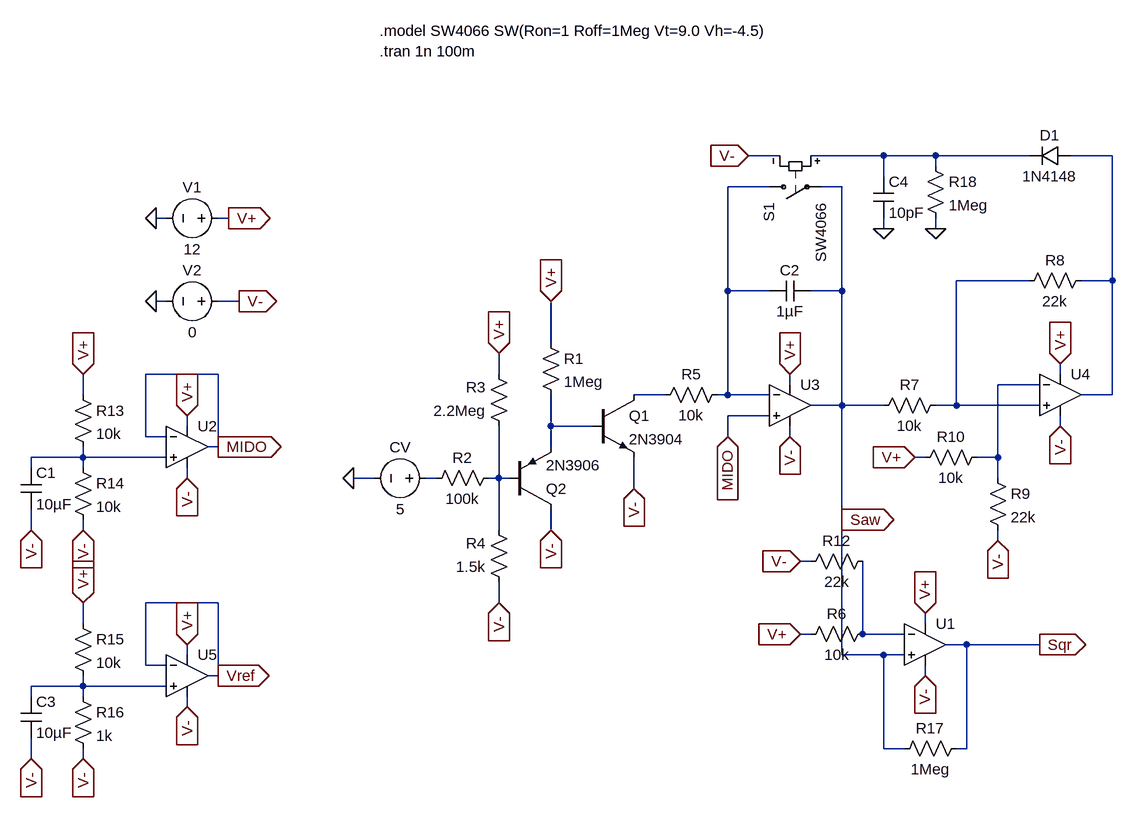
[diagram p0: schematic saw_core_4066_exp.asc]
saw_core_4066_exp.asc, the LTspice schematic file:
Version 4
SHEET 1 1448 968
WIRE 624 -32 576 -32
WIRE 784 -32 672 -32
WIRE 864 -32 784 -32
WIRE 1008 -32 864 -32
WIRE 1136 -32 1072 -32
WIRE 864 -16 864 -32
WIRE 784 0 784 -32
WIRE 608 16 544 16
WIRE 720 16 688 16
WIRE -320 64 -336 64
WIRE -224 64 -240 64
WIRE 784 80 784 64
WIRE 864 80 864 64
WIRE 1008 160 896 160
WIRE 1136 160 1136 -32
WIRE 1136 160 1088 160
WIRE 544 176 544 16
WIRE 608 176 544 176
WIRE 720 176 720 16
WIRE 720 176 672 176
WIRE -320 192 -336 192
WIRE -208 192 -240 192
WIRE 272 256 272 192
WIRE -240 304 -352 304
WIRE 192 304 192 272
WIRE 1056 304 1056 288
WIRE 640 320 640 304
WIRE 1024 320 960 320
WIRE -448 336 -448 304
WIRE 448 336 400 336
WIRE 544 336 544 176
WIRE 544 336 528 336
WIRE 608 336 544 336
WIRE 1136 336 1136 160
WIRE 1136 336 1088 336
WIRE 720 352 720 176
WIRE 720 352 672 352
WIRE 784 352 720 352
WIRE 896 352 896 160
WIRE 896 352 864 352
WIRE 1024 352 896 352
WIRE 608 368 544 368
WIRE -288 384 -288 368
WIRE 272 384 272 336
WIRE 336 384 272 384
WIRE 1056 384 1056 368
WIRE -352 400 -352 304
WIRE -320 400 -352 400
WIRE 544 400 544 368
WIRE 640 400 640 384
WIRE -240 416 -240 304
WIRE -240 416 -256 416
WIRE 272 416 272 384
WIRE -448 432 -448 416
WIRE -448 432 -528 432
WIRE -320 432 -448 432
WIRE 848 432 832 432
WIRE 960 432 960 320
WIRE 960 432 928 432
WIRE -528 448 -528 432
WIRE -448 448 -448 432
WIRE -288 464 -288 448
WIRE 0 464 -32 464
WIRE 96 464 80 464
WIRE 192 464 192 384
WIRE 192 464 176 464
WIRE 208 464 192 464
WIRE 960 464 960 432
WIRE 400 480 400 432
WIRE 720 528 720 352
WIRE -528 544 -528 512
WIRE -448 544 -448 528
WIRE 192 544 192 464
WIRE 272 544 272 512
WIRE 960 560 960 544
WIRE 672 592 656 592
WIRE -240 656 -352 656
WIRE 192 656 192 624
WIRE -448 688 -448 656
WIRE 848 688 848 672
WIRE 672 704 656 704
WIRE 752 704 752 592
WIRE 816 704 752 704
WIRE 912 720 880 720
WIRE 1024 720 912 720
WIRE -288 736 -288 720
WIRE 720 736 720 528
WIRE 784 736 720 736
WIRE 816 736 784 736
WIRE -352 752 -352 656
WIRE -320 752 -352 752
WIRE -240 768 -240 656
WIRE -240 768 -256 768
WIRE 848 768 848 752
WIRE -448 784 -448 768
WIRE -448 784 -528 784
WIRE -320 784 -448 784
WIRE -528 800 -528 784
WIRE -448 800 -448 784
WIRE -288 816 -288 800
WIRE 784 880 784 736
WIRE 816 880 784 880
WIRE 912 880 912 720
WIRE 912 880 896 880
WIRE -528 896 -528 864
WIRE -448 896 -448 880
FLAG -336 64 0
FLAG -336 192 0
FLAG -224 64 V+
IOPIN -224 64 Out
FLAG -208 192 V-
IOPIN -208 192 Out
FLAG -240 416 MIDO
IOPIN -240 416 Out
FLAG 640 304 V+
IOPIN 640 304 In
FLAG 640 400 V-
IOPIN 640 400 In
FLAG 544 400 MIDO
IOPIN 544 400 In
FLAG 1056 288 V+
IOPIN 1056 288 In
FLAG 1056 384 V-
IOPIN 1056 384 In
FLAG 576 -32 V-
IOPIN 576 -32 In
FLAG 960 560 V-
IOPIN 960 560 In
FLAG 832 432 V+
IOPIN 832 432 In
FLAG -32 464 0
FLAG 400 480 V-
IOPIN 400 480 In
FLAG 272 192 V+
IOPIN 272 192 In
FLAG 272 544 V-
IOPIN 272 544 In
FLAG 192 656 V-
IOPIN 192 656 In
FLAG 192 272 V+
IOPIN 192 272 In
FLAG -288 368 V+
IOPIN -288 368 In
FLAG -288 464 V-
IOPIN -288 464 In
FLAG -448 304 V+
IOPIN -448 304 In
FLAG -448 544 V-
IOPIN -448 544 In
FLAG -528 544 V-
IOPIN -528 544 In
FLAG -240 768 Vref
IOPIN -240 768 Out
FLAG -288 720 V+
IOPIN -288 720 In
FLAG -288 816 V-
IOPIN -288 816 In
FLAG -448 656 V+
IOPIN -448 656 In
FLAG -448 896 V-
IOPIN -448 896 In
FLAG -528 896 V-
IOPIN -528 896 In
FLAG 720 528 Saw
IOPIN 720 528 Out
FLAG 784 80 0
FLAG 848 672 V+
IOPIN 848 672 In
FLAG 848 768 V-
IOPIN 848 768 In
FLAG 1024 720 Sqr
IOPIN 1024 720 Out
FLAG 656 704 V+
IOPIN 656 704 In
FLAG 656 592 V-
IOPIN 656 592 In
FLAG 864 80 0
SYMBOL voltage -224 64 R90
WINDOW 0 -32 56 VBottom 2
WINDOW 3 32 56 VTop 2
SYMATTR InstName V1
SYMATTR Value 12
SYMBOL voltage -224 192 R90
WINDOW 0 -32 56 VBottom 2
WINDOW 3 32 56 VTop 2
SYMATTR InstName V2
SYMATTR Value 0
SYMBOL Opamps/UniversalOpamp2 640 352 R0
SYMATTR InstName U3
SYMBOL cap 672 160 R90
WINDOW 0 0 32 VBottom 2
WINDOW 3 32 32 VTop 2
SYMATTR InstName C2
SYMATTR Value 1µF
SYMBOL res 880 336 R90
WINDOW 0 0 56 VBottom 2
WINDOW 3 32 56 VTop 2
SYMATTR InstName R7
SYMATTR Value 10k
SYMBOL res 1104 144 R90
WINDOW 0 0 56 VBottom 2
WINDOW 3 32 56 VTop 2
SYMATTR InstName R8
SYMATTR Value 22k
SYMBOL Opamps/UniversalOpamp2 1056 336 R0
SYMATTR InstName U4
SYMBOL sw 592 16 M90
SYMATTR InstName S1
SYMATTR Value SW4066
SYMBOL res 944 448 R0
SYMATTR InstName R9
SYMATTR Value 22k
SYMBOL res 944 416 R90
WINDOW 0 0 56 VBottom 2
WINDOW 3 32 56 VTop 2
SYMATTR InstName R10
SYMATTR Value 10k
SYMBOL diode 1072 -48 R90
WINDOW 0 0 32 VBottom 2
WINDOW 3 32 32 VTop 2
SYMATTR InstName D1
SYMATTR Value 1N4148
SYMBOL res 544 320 R90
WINDOW 0 0 56 VBottom 2
WINDOW 3 32 56 VTop 2
SYMATTR InstName R5
SYMATTR Value 10k
SYMBOL voltage 96 464 R90
WINDOW 0 -32 56 VBottom 2
WINDOW 3 32 56 VTop 2
SYMATTR InstName CV
SYMATTR Value 5
SYMBOL npn 336 336 R0
SYMATTR InstName Q1
SYMATTR Value 2N3904
SYMBOL pnp 208 512 M180
SYMATTR InstName Q2
SYMATTR Value 2N3906
SYMBOL res 256 240 R0
SYMATTR InstName R1
SYMATTR Value 1Meg
SYMBOL res 192 448 R90
WINDOW 0 0 56 VBottom 2
WINDOW 3 32 56 VTop 2
SYMATTR InstName R2
SYMATTR Value 100k
SYMBOL res 208 400 R180
WINDOW 0 36 76 Left 2
WINDOW 3 36 40 Left 2
SYMATTR InstName R3
SYMATTR Value 2.2Meg
SYMBOL res 208 640 R180
WINDOW 0 36 76 Left 2
WINDOW 3 36 40 Left 2
SYMATTR InstName R4
SYMATTR Value 1.5k
SYMBOL Opamps/UniversalOpamp2 -288 416 R0
SYMATTR InstName U2
SYMBOL res -464 320 R0
SYMATTR InstName R13
SYMATTR Value 10k
SYMBOL res -464 432 R0
SYMATTR InstName R14
SYMATTR Value 10k
SYMBOL cap -544 448 R0
SYMATTR InstName C1
SYMATTR Value 10µF
SYMBOL Opamps/UniversalOpamp2 -288 768 R0
SYMATTR InstName U5
SYMBOL res -464 672 R0
SYMATTR InstName R15
SYMATTR Value 10k
SYMBOL res -464 784 R0
SYMATTR InstName R16
SYMATTR Value 1k
SYMBOL cap -544 800 R0
SYMATTR InstName C3
SYMATTR Value 10µF
SYMBOL cap 768 0 R0
SYMATTR InstName C4
SYMATTR Value 10pF
SYMBOL Opamps/UniversalOpamp2 848 720 R0
SYMATTR InstName U1
SYMBOL res 768 688 R90
WINDOW 0 0 56 VBottom 2
WINDOW 3 32 56 VTop 2
SYMATTR InstName R6
SYMATTR Value 10k
SYMBOL res 768 576 R90
WINDOW 0 0 56 VBottom 2
WINDOW 3 32 56 VTop 2
SYMATTR InstName R12
SYMATTR Value 22k
SYMBOL res 912 864 R90
WINDOW 0 0 56 VBottom 2
WINDOW 3 32 56 VTop 2
SYMATTR InstName R17
SYMATTR Value 1Meg
SYMBOL res 848 -32 R0
SYMATTR InstName R18
SYMATTR Value 1Meg
TEXT 8 -224 Left 2 !.model SW4066 SW(Ron=1 Roff=1Meg Vt=9.0 Vh=-4.5)\n.tran 1n 100m

The netlist it stands for:
* saw_core_4066_exp.asc
V1 V+ 0 12
V2 V- 0 0
XU3 MIDO N003 V+ V- Saw level.2 Avol=1Meg GBW=10Meg Slew=10Meg ilimit=25m rail=0 Vos=0 phimargin=45 en=0 enk=0 in=0 ink=0 Rin=500Meg  ; pins IN+ IN- V+ V- OUT
C2 Saw N003 1µF
R7 N004 Saw 10k
R8 N002 N004 22k
XU4 N004 N005 V+ V- N002 level.2 Avol=1Meg GBW=10Meg Slew=10Meg ilimit=25m rail=0 Vos=0 phimargin=45 en=0 enk=0 in=0 ink=0 Rin=500Meg  ; pins IN+ IN- V+ V- OUT
S1 N003 Saw N001 V- SW4066
R9 N005 V- 22k
R10 N005 V+ 10k
D1 N002 N001 1N4148
R5 N003 N006 10k
V§CV N009 0 5
Q1 N006 N007 V- 0 2N3904
Q2 V- N010 N007 0 2N3906
R1 V+ N007 1Meg
R2 N010 N009 100k
R3 N010 V+ 2.2Meg
R4 V- N010 1.5k
XU2 N008 MIDO V+ V- MIDO level.2 Avol=1Meg GBW=10Meg Slew=10Meg ilimit=25m rail=0 Vos=0 phimargin=45 en=0 enk=0 in=0 ink=0 Rin=500Meg  ; pins IN+ IN- V+ V- OUT
R13 V+ N008 10k
R14 N008 V- 10k
C1 N008 V- 10µF
XU5 N012 Vref V+ V- Vref level.2 Avol=1Meg GBW=10Meg Slew=10Meg ilimit=25m rail=0 Vos=0 phimargin=45 en=0 enk=0 in=0 ink=0 Rin=500Meg  ; pins IN+ IN- V+ V- OUT
R15 V+ N012 10k
R16 N012 V- 1k
C3 N012 V- 10µF
C4 N001 0 10pF
XU1 Saw N011 V+ V- Sqr level.2 Avol=1Meg GBW=10Meg Slew=10Meg ilimit=25m rail=0 Vos=0 phimargin=45 en=0 enk=0 in=0 ink=0 Rin=500Meg  ; pins IN+ IN- V+ V- OUT
R6 N011 V+ 10k
R12 N011 V- 22k
R17 Sqr Saw 1Meg
R18 N001 0 1Meg
.model D D
.lib standard.dio
.model NPN NPN
.model PNP PNP
.lib standard.bjt
.model SW4066 SW(Ron=1 Roff=1Meg Vt=9.0 Vh=-4.5)
.tran 1n 100m
.lib UniversalOpamps2.sub
.backanno
.end